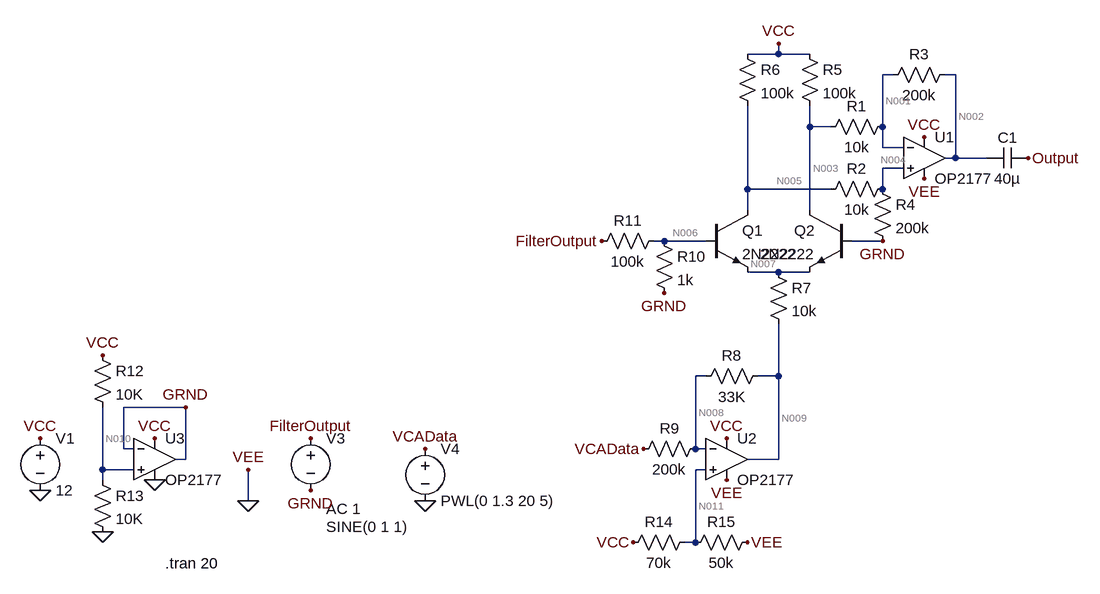
[diagram p0: schematic potentiele oplossing VCA.asc]
potentiele oplossing VCA.asc, the LTspice schematic file:
Version 4
SHEET 1 880 948
WIRE -64 16 -64 0
WIRE -64 16 -112 16
WIRE -16 16 -64 16
WIRE 112 48 96 48
WIRE 208 48 192 48
WIRE -16 128 -16 96
WIRE 16 128 -16 128
WIRE 96 128 96 48
WIRE 96 160 96 128
WIRE 128 160 96 160
WIRE 208 176 208 48
WIRE 208 176 192 176
WIRE 256 176 208 176
WIRE 128 192 96 192
WIRE -112 224 -112 96
WIRE 16 224 -112 224
WIRE 96 224 96 192
WIRE -112 256 -112 224
WIRE -16 256 -16 128
WIRE -240 304 -256 304
WIRE -176 304 -240 304
WIRE 96 304 48 304
WIRE -64 352 -112 352
WIRE -16 352 -64 352
WIRE -176 512 -192 512
WIRE -64 512 -64 432
WIRE -64 512 -96 512
WIRE -976 560 -1072 560
WIRE -1072 624 -1072 560
WIRE -1056 624 -1072 624
WIRE -192 624 -192 512
WIRE -176 624 -192 624
WIRE -976 640 -976 560
WIRE -976 640 -992 640
WIRE -64 640 -64 512
WIRE -64 640 -112 640
WIRE -1104 656 -1104 560
WIRE -1056 656 -1104 656
WIRE -176 656 -192 656
WIRE -1104 672 -1104 656
WIRE -880 704 -880 656
WIRE -192 768 -192 656
WIRE -192 768 -208 768
FLAG -240 384 GRND
FLAG 96 304 GRND
FLAG 160 144 VCC
FLAG 160 208 VEE
FLAG -64 0 VCC
FLAG -336 304 FilterOutput
FLAG 320 176 Output
FLAG -784 608 FilterOutput
FLAG -1200 608 VCC
FLAG -880 704 0
FLAG -880 656 VEE
FLAG -1200 688 0
FLAG -1104 752 0
FLAG -1104 480 VCC
FLAG -1024 608 VCC
FLAG -1024 672 0
FLAG -976 560 GRND
FLAG -784 688 GRND
FLAG -144 608 VCC
FLAG -144 672 VEE
FLAG -288 768 VCC
FLAG -112 768 VEE
FLAG -608 704 0
FLAG -608 624 VCAData
FLAG -272 624 VCAData
SYMBOL OpAmps\\OP2177 160 112 R0
SYMATTR InstName U1
SYMBOL res 112 112 R90
WINDOW 0 0 56 VBottom 2
WINDOW 3 32 56 VTop 2
SYMATTR InstName R1
SYMATTR Value 10k
SYMBOL res 112 208 R90
WINDOW 0 0 56 VBottom 2
WINDOW 3 32 56 VTop 2
SYMATTR InstName R2
SYMATTR Value 10k
SYMBOL res 96 64 R270
WINDOW 0 32 56 VTop 2
WINDOW 3 0 56 VBottom 2
SYMATTR InstName R3
SYMATTR Value 200k
SYMBOL npn -176 256 R0
SYMATTR InstName Q1
SYMATTR Value 2N2222
SYMBOL npn 48 256 M0
SYMATTR InstName Q2
SYMATTR Value 2N2222
SYMBOL res 80 208 R0
SYMATTR InstName R4
SYMATTR Value 200k
SYMBOL res -32 0 R0
SYMATTR InstName R5
SYMATTR Value 100k
SYMBOL res -128 0 R0
SYMATTR InstName R6
SYMATTR Value 100k
SYMBOL res -80 336 R0
SYMATTR InstName R7
SYMATTR Value 10k
SYMBOL res -80 496 R90
WINDOW 0 0 56 VBottom 2
WINDOW 3 32 56 VTop 2
SYMATTR InstName R8
SYMATTR Value 33K
SYMBOL res -176 608 R90
WINDOW 0 0 56 VBottom 2
WINDOW 3 32 56 VTop 2
SYMATTR InstName R9
SYMATTR Value 200k
SYMBOL res -256 288 R0
SYMATTR InstName R10
SYMATTR Value 1k
SYMBOL res -240 288 R90
WINDOW 0 0 56 VBottom 2
WINDOW 3 32 56 VTop 2
SYMATTR InstName R11
SYMATTR Value 100k
SYMBOL cap 320 160 R90
WINDOW 0 0 32 VBottom 2
WINDOW 3 32 32 VTop 2
SYMATTR InstName C1
SYMATTR Value 40µ
SYMBOL voltage -1200 592 R0
WINDOW 123 0 0 Left 0
WINDOW 39 0 0 Left 0
SYMATTR InstName V1
SYMATTR Value 12
SYMBOL voltage -784 592 R0
WINDOW 3 24 152 Left 2
WINDOW 123 24 124 Left 2
WINDOW 39 0 0 Left 0
SYMATTR Value SINE(0 1 1)
SYMATTR Value2 AC 1
SYMATTR InstName V3
SYMBOL voltage -608 608 R0
WINDOW 123 0 0 Left 0
WINDOW 39 0 0 Left 0
SYMATTR InstName V4
SYMATTR Value PWL(0 1.3 20 5)
SYMBOL OpAmps\\OP2177 -1024 576 R0
SYMATTR InstName U3
SYMBOL res -1120 464 R0
SYMATTR InstName R12
SYMATTR Value 10K
SYMBOL res -1120 656 R0
SYMATTR InstName R13
SYMATTR Value 10K
SYMBOL OpAmps\\OP2177 -144 576 R0
SYMATTR InstName U2
SYMBOL res -304 784 R270
WINDOW 0 32 56 VTop 2
WINDOW 3 0 56 VBottom 2
SYMATTR InstName R14
SYMATTR Value 70k
SYMBOL res -208 784 R270
WINDOW 0 32 56 VTop 2
WINDOW 3 0 56 VBottom 2
SYMATTR InstName R15
SYMATTR Value 50k
TEXT -1008 800 Left 2 !.tran 20

The netlist it stands for:
* potentiele oplossing VCA.asc
XU1 N004 N001 VCC 0 N002 OP2177  ; pins In+ In- V+ V- OUT
R1 N001 N003 10k
R2 N004 N005 10k
R3 N001 N002 200k
Q1 N005 N006 N007 0 2N2222
Q2 N003 GRND N007 0 2N2222
R4 N004 GRND 200k
R5 VCC N003 100k
R6 VCC N005 100k
R7 N007 N009 10k
R8 N009 N008 33K
R9 N008 VCAData 200k
R10 N006 GRND 1k
R11 N006 FilterOutput 100k
C1 Output N002 40µ
V1 VCC 0 12
V3 FilterOutput GRND SINE(0 1 1) AC 1
V4 VCAData 0 PWL(0 1.3 20 5)
XU3 N010 GRND VCC 0 GRND OP2177  ; pins In+ In- V+ V- OUT
R12 VCC N010 10K
R13 N010 0 10K
XU2 N011 N008 VCC 0 N009 OP2177  ; pins In+ In- V+ V- OUT
R14 VCC N011 70k
R15 N011 0 50k
.model NPN NPN
.model PNP PNP
.lib standard.bjt
.tran 20
.backanno
.end

* Results of the author's LTspice run, read from the files saved beside the schematic
* Operating Point, zero values left out:
*   V(n004) = 9.869 V
*   V(n001) = 9.869 V
*   V(vcc) = 12 V
*   V(n002) = 6 V
*   V(n003) = 10.06 V
*   V(n005) = 10.06 V
*   V(n006) = 6 V
*   V(n007) = 5.611 V
*   V(grnd) = 6 V
*   V(n009) = 5.61 V
*   V(n008) = 5 V
*   V(vcadata) = 1.3 V
*   V(filteroutput) = 6 V
*   V(output) = 240 µV
*   V(n010) = 6 V
*   V(n011) = 5 V
*   Ic(Q1) = 35.13 nA
*   Ib(Q1) = 165.1 pA
*   Ie(Q1) = -35.29 nA
*   Ic(Q2) = 35.13 nA
*   Ib(Q2) = 165.1 pA
*   Ie(Q2) = -35.29 nA
*   I(R1) = -19.34 µA
*   I(R2) = -19.34 µA
*   I(R3) = 19.34 µA
*   I(R4) = 19.34 µA
*   I(R5) = 19.38 µA
*   I(R6) = 19.38 µA
*   I(R7) = 70.59 nA
*   I(R8) = 18.5 µA
*   I(R9) = 18.5 µA
*   I(R10) = -163.5 pA
*   I(R11) = -1.635 pA
*   I(R12) = 600 µA
*   I(R13) = 600 µA
*   I(R14) = 100 µA
*   I(R15) = 100 µA
*   I(V1) = -1.687 mA
*   I(V3) = -1.635 pA
*   I(V4) = 18.5 µA
*   Ix(u1:1) = -392.6 pA
*   Ix(u1:2) = -592.6 pA
*   Ix(u1:99) = 310 µA
*   Ix(u1:50) = -329.3 µA
*   Ix(u1:34) = 19.34 µA
*   Ix(u3:1) = -396.4 pA
*   Ix(u3:2) = -596.4 pA
*   Ix(u3:99) = 310 µA
*   Ix(u3:50) = -329.3 µA
*   Ix(u3:34) = 19.34 µA
*   Ix(u2:1) = -397.4 pA
*   Ix(u2:2) = -597.4 pA
*   Ix(u2:99) = 328.4 µA
*   Ix(u2:50) = -310 µA
*   Ix(u2:34) = -18.43 µA
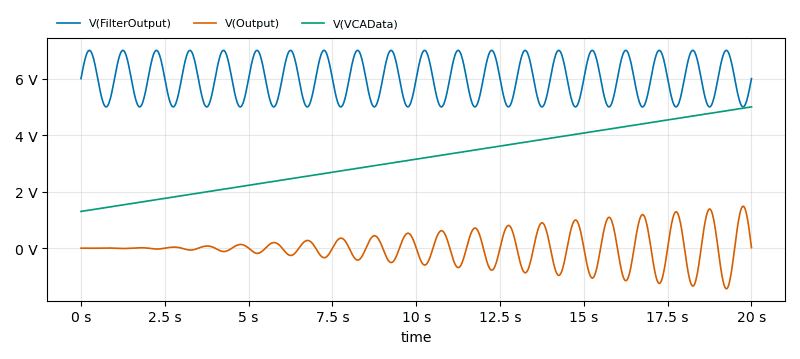
[diagram p1: Transient Analysis of potentiele oplossing VCA.asc, plotted from the saved traces]
* Transient Analysis, 1 run:
*   V(FilterOutput): min 5 V, max 7 V, average 6 V, rms 6.042 V, last 6 V
*   V(Output): min -1.438 V, max 1.485 V, average 10.43 mV, rms 550.4 mV, last 16.73 mV
*   V(VCAData): min 1.3 V, max 5 V, average 3.15 V, rms 3.326 V, last 5 V